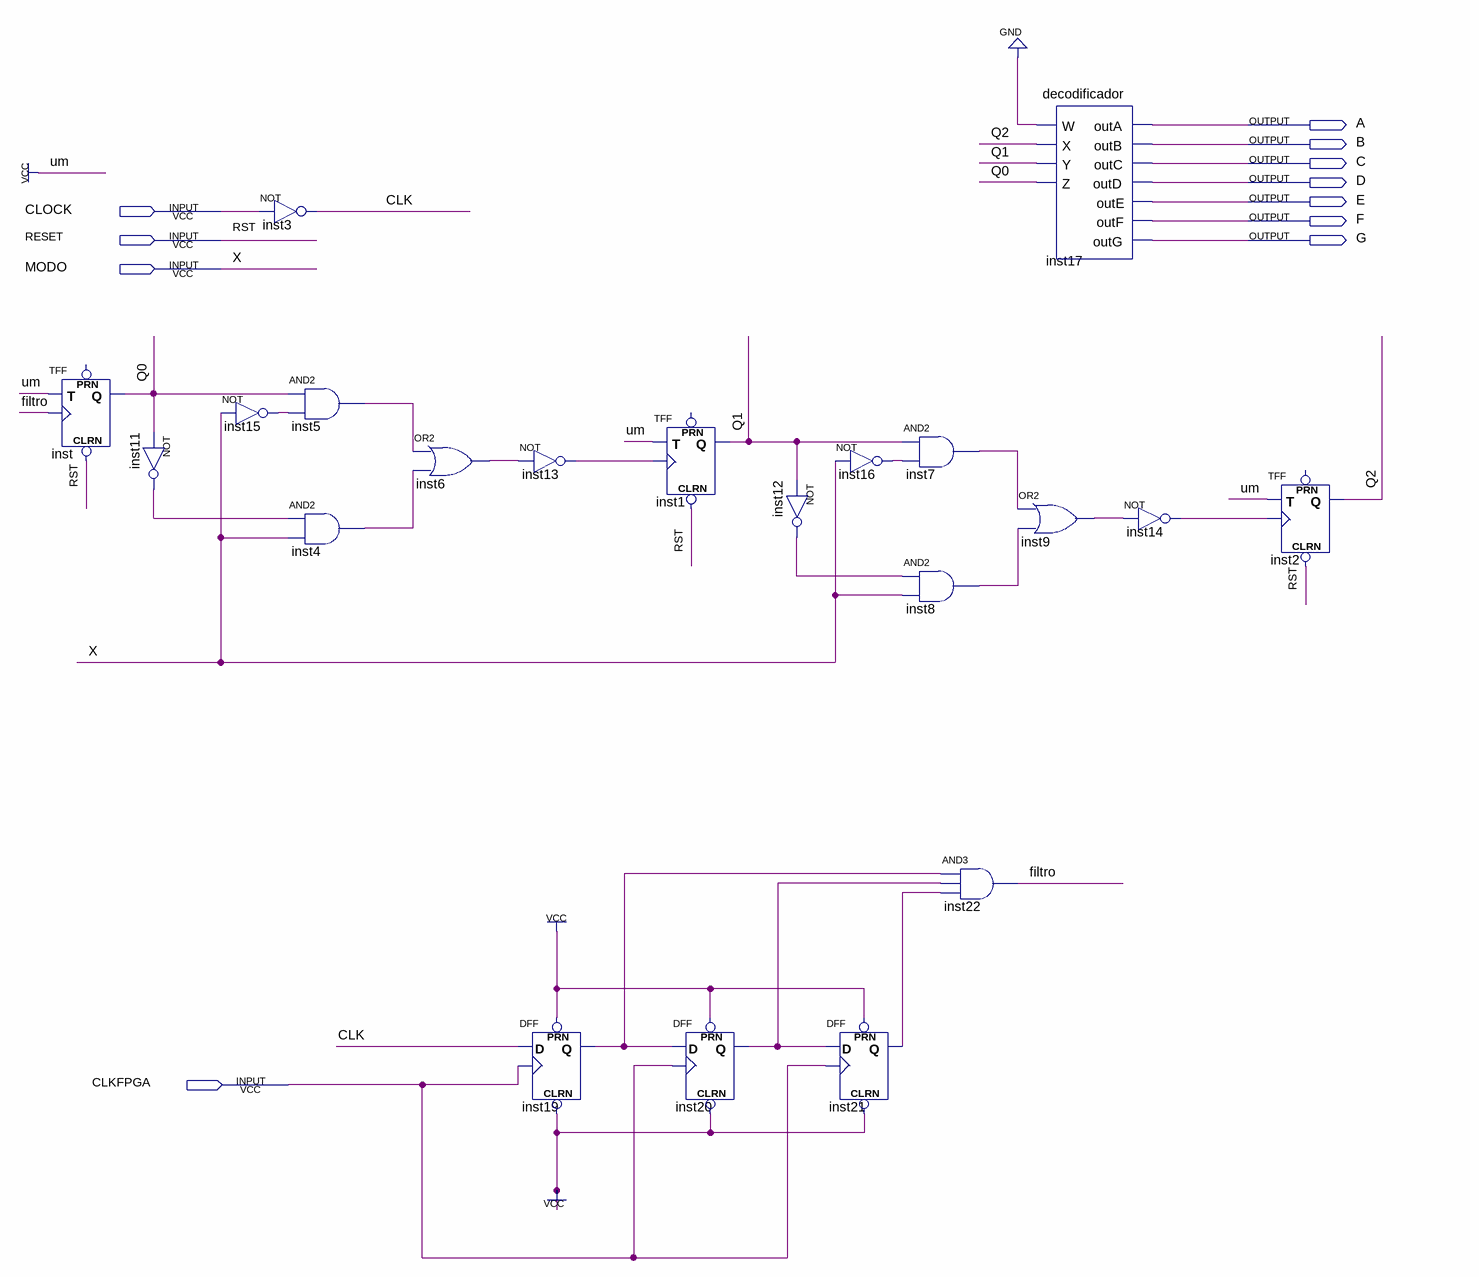
[diagram p0: schematic sheet]
// Quartus schematic contador_filtro.bdf as structural Verilog: 21 symbols, 11 pins
module contador_filtro (
  input  CLOCK,
  input  RESET,
  input  MODO,
  input  CLKFPGA,
  output A,
  output B,
  output C,
  output D,
  output E,
  output F,
  output G
);

  wire CLK, filtro, inst4_out, inst5_out, inst6_out, inst7_out, inst8_out, inst9_out, inst11_out, inst12_out,
       inst13_out, inst14_out, inst15_out, inst16_out, inst19_q, inst20_q, inst21_q, Q0, Q1, Q2;

  TFF inst (.CLRN(RESET), .T(1'b1), .CLK(filtro), .Q(Q0));  // open: PRN
  not inst11 (inst11_out, Q0);
  not inst15 (inst15_out, MODO);
  not inst3 (CLK, CLOCK);
  and inst5 (inst5_out, Q0, inst15_out);
  and inst4 (inst4_out, inst11_out, MODO);
  or inst6 (inst6_out, inst5_out, inst4_out);
  not inst13 (inst13_out, inst6_out);
  DFF inst19 (.CLRN(1'b1), .CLK(CLKFPGA), .D(CLK), .PRN(1'b1), .Q(inst19_q));
  TFF inst1 (.CLRN(RESET), .T(1'b1), .CLK(inst13_out), .Q(Q1));  // open: PRN
  DFF inst20 (.CLRN(1'b1), .CLK(CLKFPGA), .D(inst19_q), .PRN(1'b1), .Q(inst20_q));
  not inst12 (inst12_out, Q1);
  not inst16 (inst16_out, MODO);
  DFF inst21 (.CLRN(1'b1), .CLK(CLKFPGA), .D(inst20_q), .PRN(1'b1), .Q(inst21_q));
  and inst7 (inst7_out, Q1, inst16_out);
  and inst8 (inst8_out, inst12_out, MODO);
  and inst22 (filtro, inst19_q, inst20_q, inst21_q);
  or inst9 (inst9_out, inst7_out, inst8_out);
  decodificador inst17 (
    .W(1'b0), .X(Q2), .Y(Q1), .Z(Q0), .outA(A), .outB(B), .outC(C), .outD(D), .outE(E), .outF(F), .outG(G));
  not inst14 (inst14_out, inst9_out);
  TFF inst2 (.CLRN(RESET), .T(1'b1), .CLK(inst14_out), .Q(Q2));  // open: PRN

  // Other names for the same wires on the sheet: RST = RESET; X = MODO
endmodule
